# EAGLE schematic CONRAD (EAGLE 9.4.2)

## Sheet 1 of 5
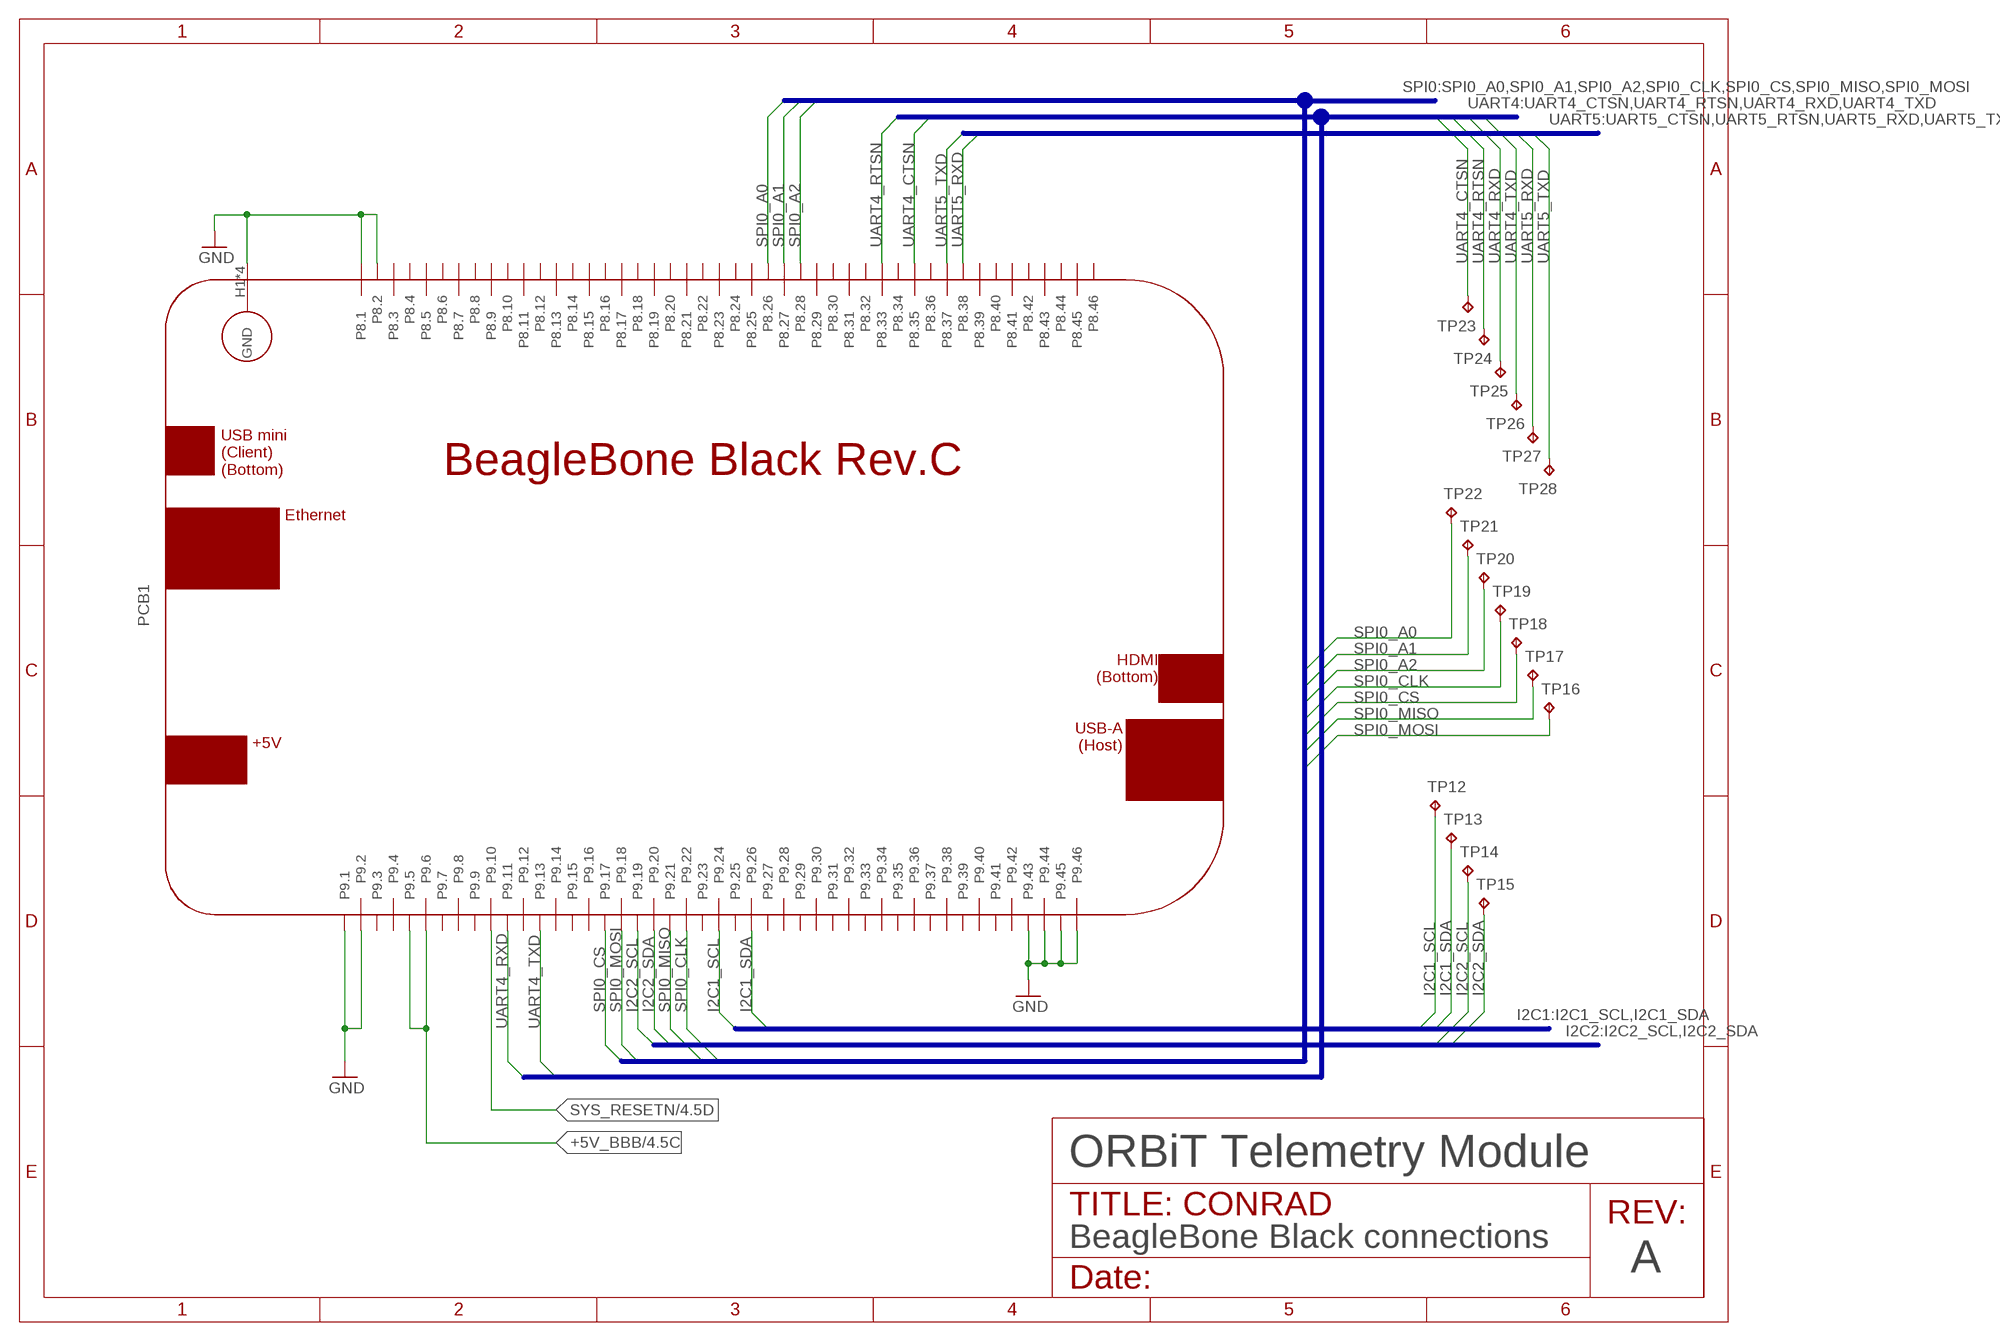
[diagram p0: schematic, sheet 1]

### Parts
PCB1  BBB_CAPE-CUT  [BBB_CAPE_CUT]
TP12  TP063  [TP_063]
TP13  TP063  [TP_063]
TP14  TP063  [TP_063]
TP15  TP063  [TP_063]
TP16  TP063  [TP_063]
TP17  TP063  [TP_063]
TP18  TP063  [TP_063]
TP19  TP063  [TP_063]
TP20  TP063  [TP_063]
TP21  TP063  [TP_063]
TP22  TP063  [TP_063]
TP23  TP063  [TP_063]
TP24  TP063  [TP_063]
TP25  TP063  [TP_063]
TP26  TP063  [TP_063]
TP27  TP063  [TP_063]
TP28  TP063  [TP_063]

### Nets
+5V_BBB: PCB1.P9.5 PCB1.P9.6 ; also sheet 4
GND: PCB1.H1(GND) PCB1.H2(GND) PCB1.H3(GND) PCB1.H4(GND) PCB1.P8.1 PCB1.P8.2 PCB1.P9.1 PCB1.P9.2 PCB1.P9.43 PCB1.P9.44 PCB1.P9.45 PCB1.P9.46 ; also sheet 2,3,4,5
I2C1_SCL: PCB1.P9.24 TP12.TP ; also sheet 2,4
I2C1_SDA: PCB1.P9.26 TP13.TP ; also sheet 2,4
I2C2_SCL: PCB1.P9.19 TP14.TP ; also sheet 4,5
I2C2_SDA: PCB1.P9.20 TP15.TP ; also sheet 4,5
SPI0_A0: PCB1.P8.26 TP22.TP ; also sheet 3
SPI0_A1: PCB1.P8.27 TP21.TP ; also sheet 3
SPI0_A2: PCB1.P8.28 TP20.TP ; also sheet 3
SPI0_CLK: PCB1.P9.22 TP19.TP ; also sheet 3
SPI0_CS: PCB1.P9.17 TP18.TP ; also sheet 3
SPI0_MISO: PCB1.P9.21 TP17.TP ; also sheet 3
SPI0_MOSI: PCB1.P9.18 TP16.TP ; also sheet 3
SYS_RESETN: PCB1.P9.10 ; also sheet 4
UART4_CTSN: PCB1.P8.35 TP23.TP ; also sheet 2
UART4_RTSN: PCB1.P8.33 TP24.TP ; also sheet 2
UART4_RXD: PCB1.P9.11 TP25.TP ; also sheet 2
UART4_TXD: PCB1.P9.13 TP26.TP ; also sheet 2
UART5_RXD: PCB1.P8.38 TP27.TP ; also sheet 2
UART5_TXD: PCB1.P8.37 TP28.TP ; also sheet 2
Unconnected: PCB1.P8.3 PCB1.P8.4 PCB1.P8.5 PCB1.P8.6 PCB1.P8.7 PCB1.P8.8 PCB1.P8.9 PCB1.P8.10 PCB1.P8.11 PCB1.P8.12 PCB1.P8.13 PCB1.P8.14 PCB1.P8.15 PCB1.P8.16 PCB1.P8.17 PCB1.P8.18 PCB1.P8.19 PCB1.P8.20 PCB1.P8.21 PCB1.P8.22 PCB1.P8.23 PCB1.P8.24 PCB1.P8.25 PCB1.P8.29 PCB1.P8.30 PCB1.P8.31 PCB1.P8.32 PCB1.P8.34 PCB1.P8.36 PCB1.P8.39 PCB1.P8.40 PCB1.P8.41 PCB1.P8.42 PCB1.P8.43 PCB1.P8.44 PCB1.P8.45 PCB1.P8.46 PCB1.P9.3 PCB1.P9.4 PCB1.P9.7 PCB1.P9.8 PCB1.P9.9 PCB1.P9.12 PCB1.P9.14 PCB1.P9.15 PCB1.P9.16 PCB1.P9.23 PCB1.P9.25 PCB1.P9.27 PCB1.P9.28 PCB1.P9.29 PCB1.P9.30 PCB1.P9.31 PCB1.P9.32 PCB1.P9.33 PCB1.P9.34 PCB1.P9.35 PCB1.P9.36 PCB1.P9.37 PCB1.P9.38 PCB1.P9.39 PCB1.P9.40 PCB1.P9.41 PCB1.P9.42

### Buses
UART4:UART4_CTSN,UART4_RTSN,UART4_RXD,UART4_TXD
UART5:UART5_CTSN,UART5_RTSN,UART5_RXD,UART5_TXD
SPI0:SPI0_A0,SPI0_A1,SPI0_A2,SPI0_CLK,SPI0_CS,SPI0_MISO,SPI0_MOSI
I2C1:I2C1_SCL,I2C1_SDA
I2C2:I2C2_SCL,I2C2_SDA

### Notes on the sheet
- ORBiT Telemetry Module
- BeagleBone Black connections
- A

## Sheet 2 of 5
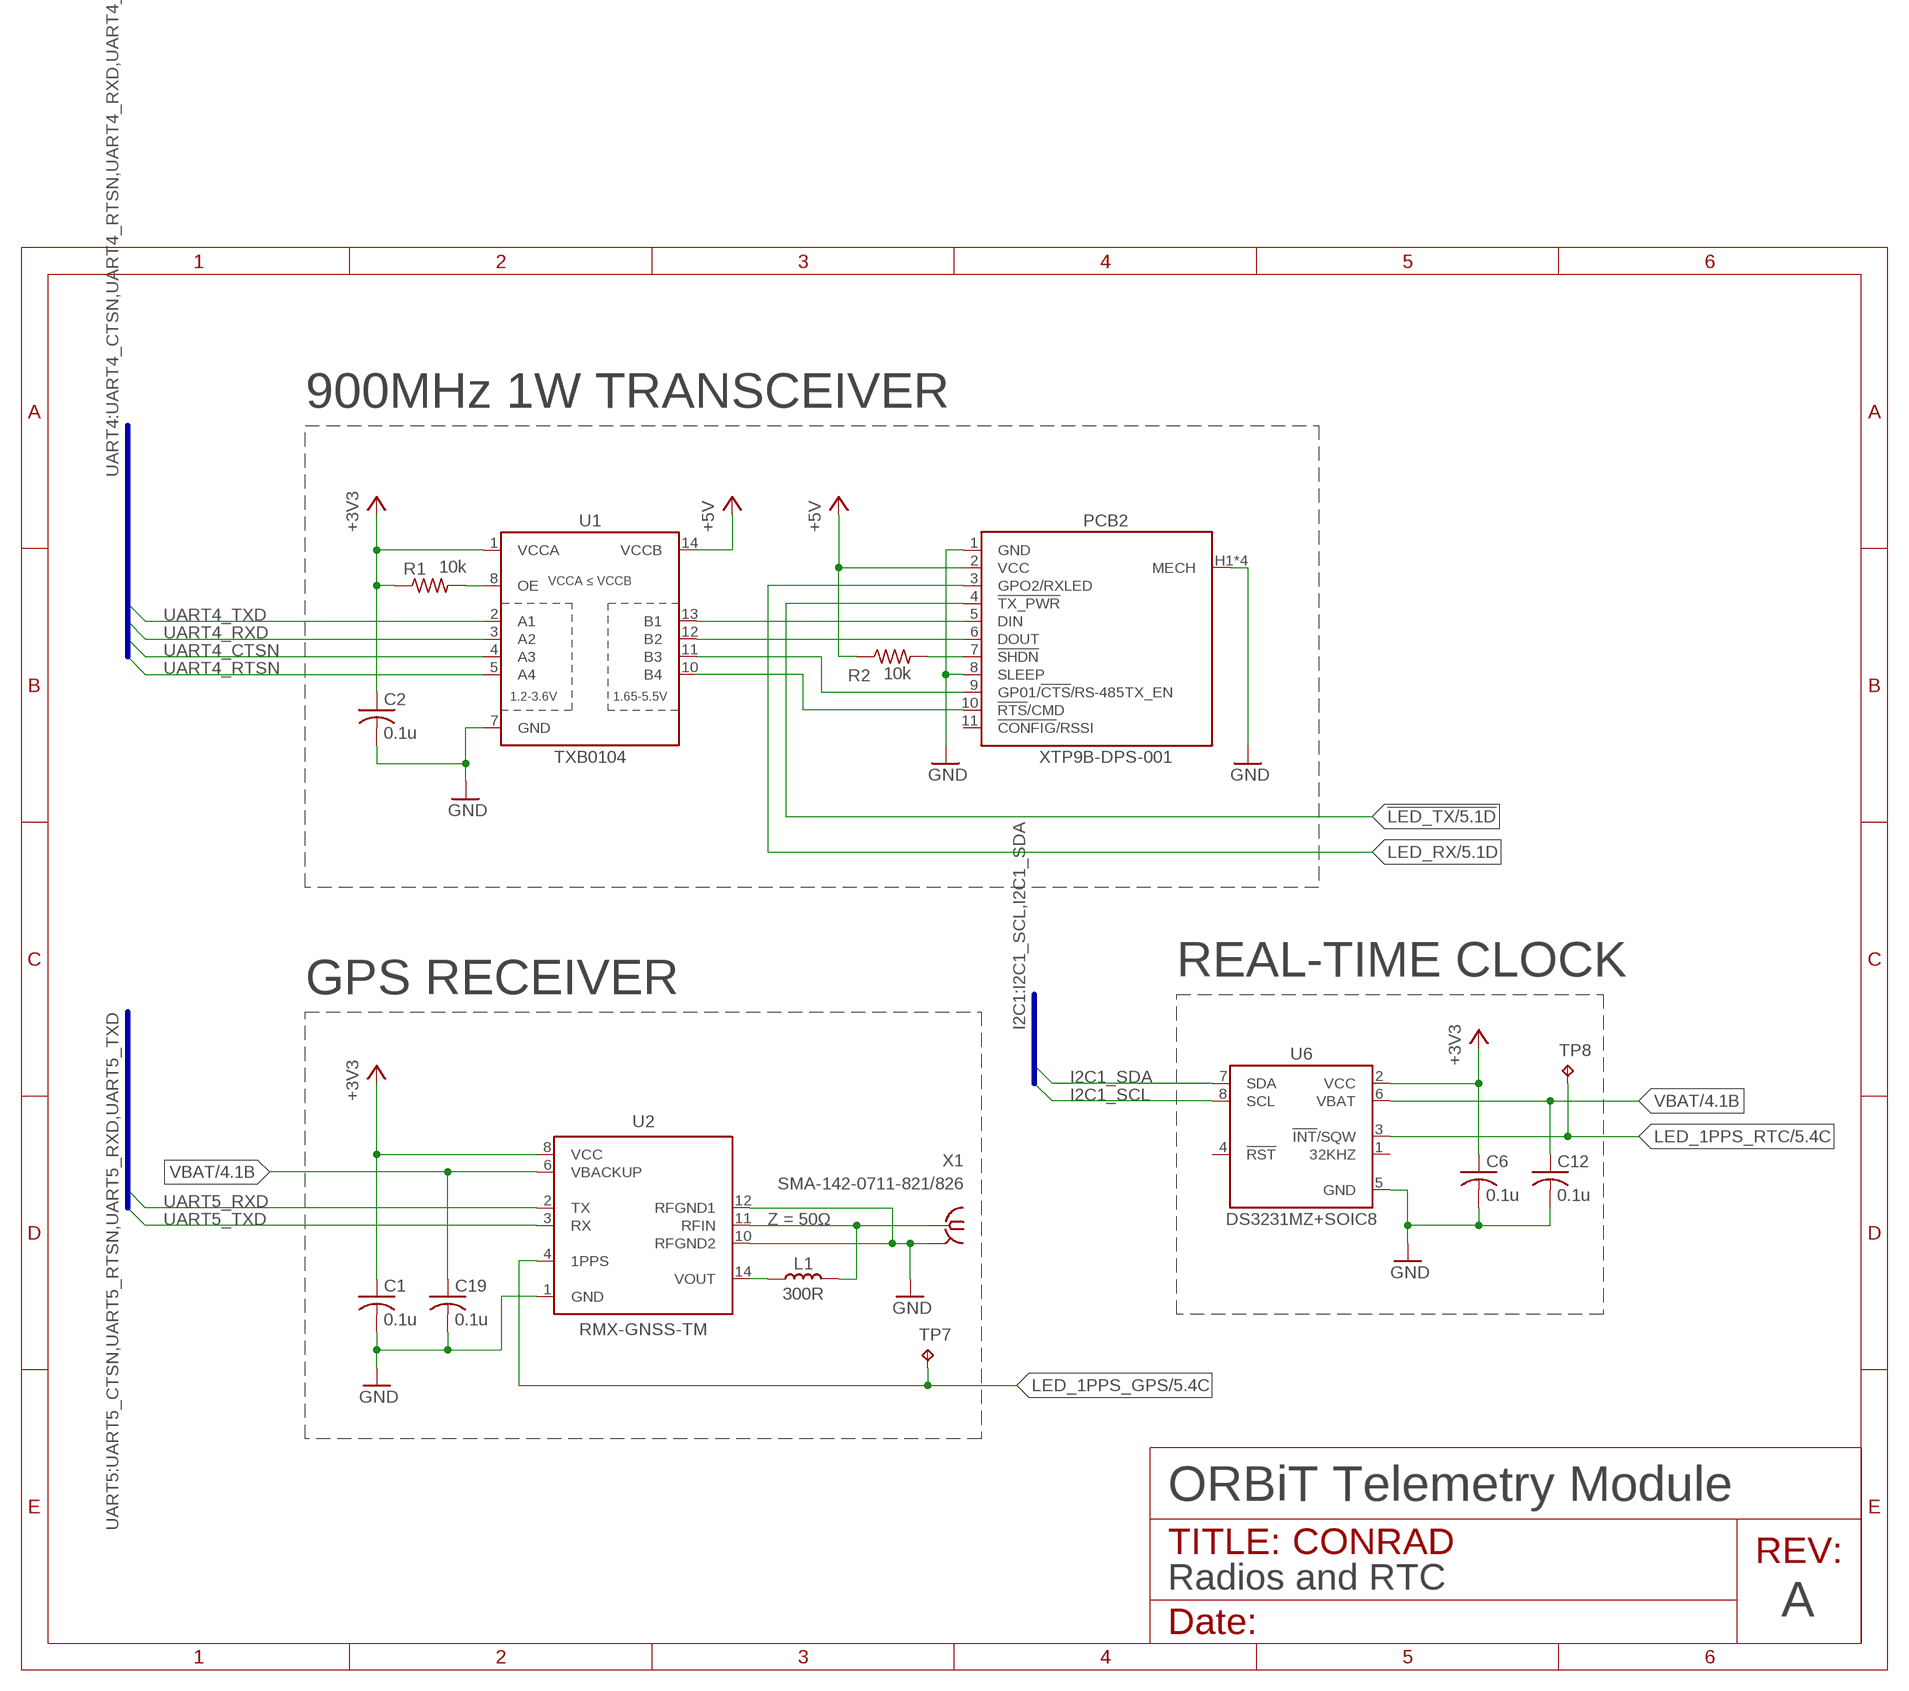
[diagram p1: schematic, sheet 2]

### Parts
C1  0.1u  C-USC0805  [C0805]
C2  0.1u  C-USC0805  [C0805]
C6  0.1u  C-USC0805  [C0805]
C12  0.1u  C-USC0805  [C0805]
C19  0.1u  C-USC0805  [C0805]
L1  300R  L_SMD0402  [0402]
PCB2  DIGI_XTP9B-RPSMA-SMD  [DIGI_XTP9B-SMD]
R1  10k  R-US_R0805  [R0805]
R2  10k  R-US_R0805  [R0805]
TP7  TP063  [TP_063]
TP8  TP063  [TP_063]
U1  TXB0104  TXB0104DR  [SO14]
U2  RMX-GNSS-TM  [RMX-GNSS-TM]
U6  DS3231MZ+SOIC8  [SOIC8-150]
X1  SMA-142-0711-821/826  [J502-ND-142-0711-821/826]

### Nets
!LED_TX: PCB2.4(!TX_PWR!) ; also sheet 5
+3V3: C1.1 C2.1 C6.1 R1.1 U1.1(VCCA) U2.8(VCC) U6.2(VCC) ; also sheet 3,4,5
+5V: U1.14(VCCB) ; also sheet 4,5
GND: C1.2 C2.2 C6.2 C12.2 C19.2 PCB2.1(GND) PCB2.8(SLEEP) PCB2.H1(MECH) PCB2.H2(MECH) PCB2.H3(MECH) PCB2.H4(MECH) U1.7(GND) U2.1(GND) U2.10(RFGND2) U2.12(RFGND1) U6.5(GND) X1.G@1 X1.G@2 X1.G@3 X1.G@4 ; also sheet 1,3,4,5
I2C1_SCL: U6.8(SCL) ; also sheet 1,4
I2C1_SDA: U6.7(SDA) ; also sheet 1,4
LED_1PPS_GPS: TP7.TP U2.4(1PPS) ; also sheet 5
LED_1PPS_RTC: TP8.TP U6.3(!INT!/SQW) ; also sheet 5
LED_RX: PCB2.3(GPO2/RXLED) ; also sheet 5
N$1: PCB2.5(DIN) U1.13(B1)
N$2: PCB2.6(DOUT) U1.12(B2)
N$3: PCB2.9(GP01/!CTS!/RS-485TX_EN) U1.11(B3)
N$4: PCB2.10(!RTS!/CMD) U1.10(B4)
N$5: R1.2 U1.8(OE)
N$6: PCB2.7(!SHDN!) R2.2
N$7: L1.2 U2.11(RFIN) X1.1
N$8: L1.1 U2.14(VOUT)
UART4_CTSN: U1.4(A3) ; also sheet 1
UART4_RTSN: U1.5(A4) ; also sheet 1
UART4_RXD: U1.3(A2) ; also sheet 1
UART4_TXD: U1.2(A1) ; also sheet 1
UART5_RXD: U2.2(TX) ; also sheet 1
UART5_TXD: U2.3(RX) ; also sheet 1
VBAT: C12.1 C19.1 U2.6(VBACKUP) U6.6(VBAT) ; also sheet 4
VCC: PCB2.2(VCC) R2.1 ; supply symbol labelled +5V
Unconnected: PCB2.11(!CONFIG!/RSSI) U6.1(32KHZ) U6.4(!RST)

### Buses
UART4:UART4_CTSN,UART4_RTSN,UART4_RXD,UART4_TXD
UART5:UART5_CTSN,UART5_RTSN,UART5_RXD,UART5_TXD
I2C1:I2C1_SCL,I2C1_SDA

### Notes on the sheet
- 900MHz 1W TRANSCEIVER
- REAL-TIME CLOCK
- GPS RECEIVER
- Z = 50Ω
- ORBiT Telemetry Module
- Radios and RTC
- A

## Sheet 3 of 5
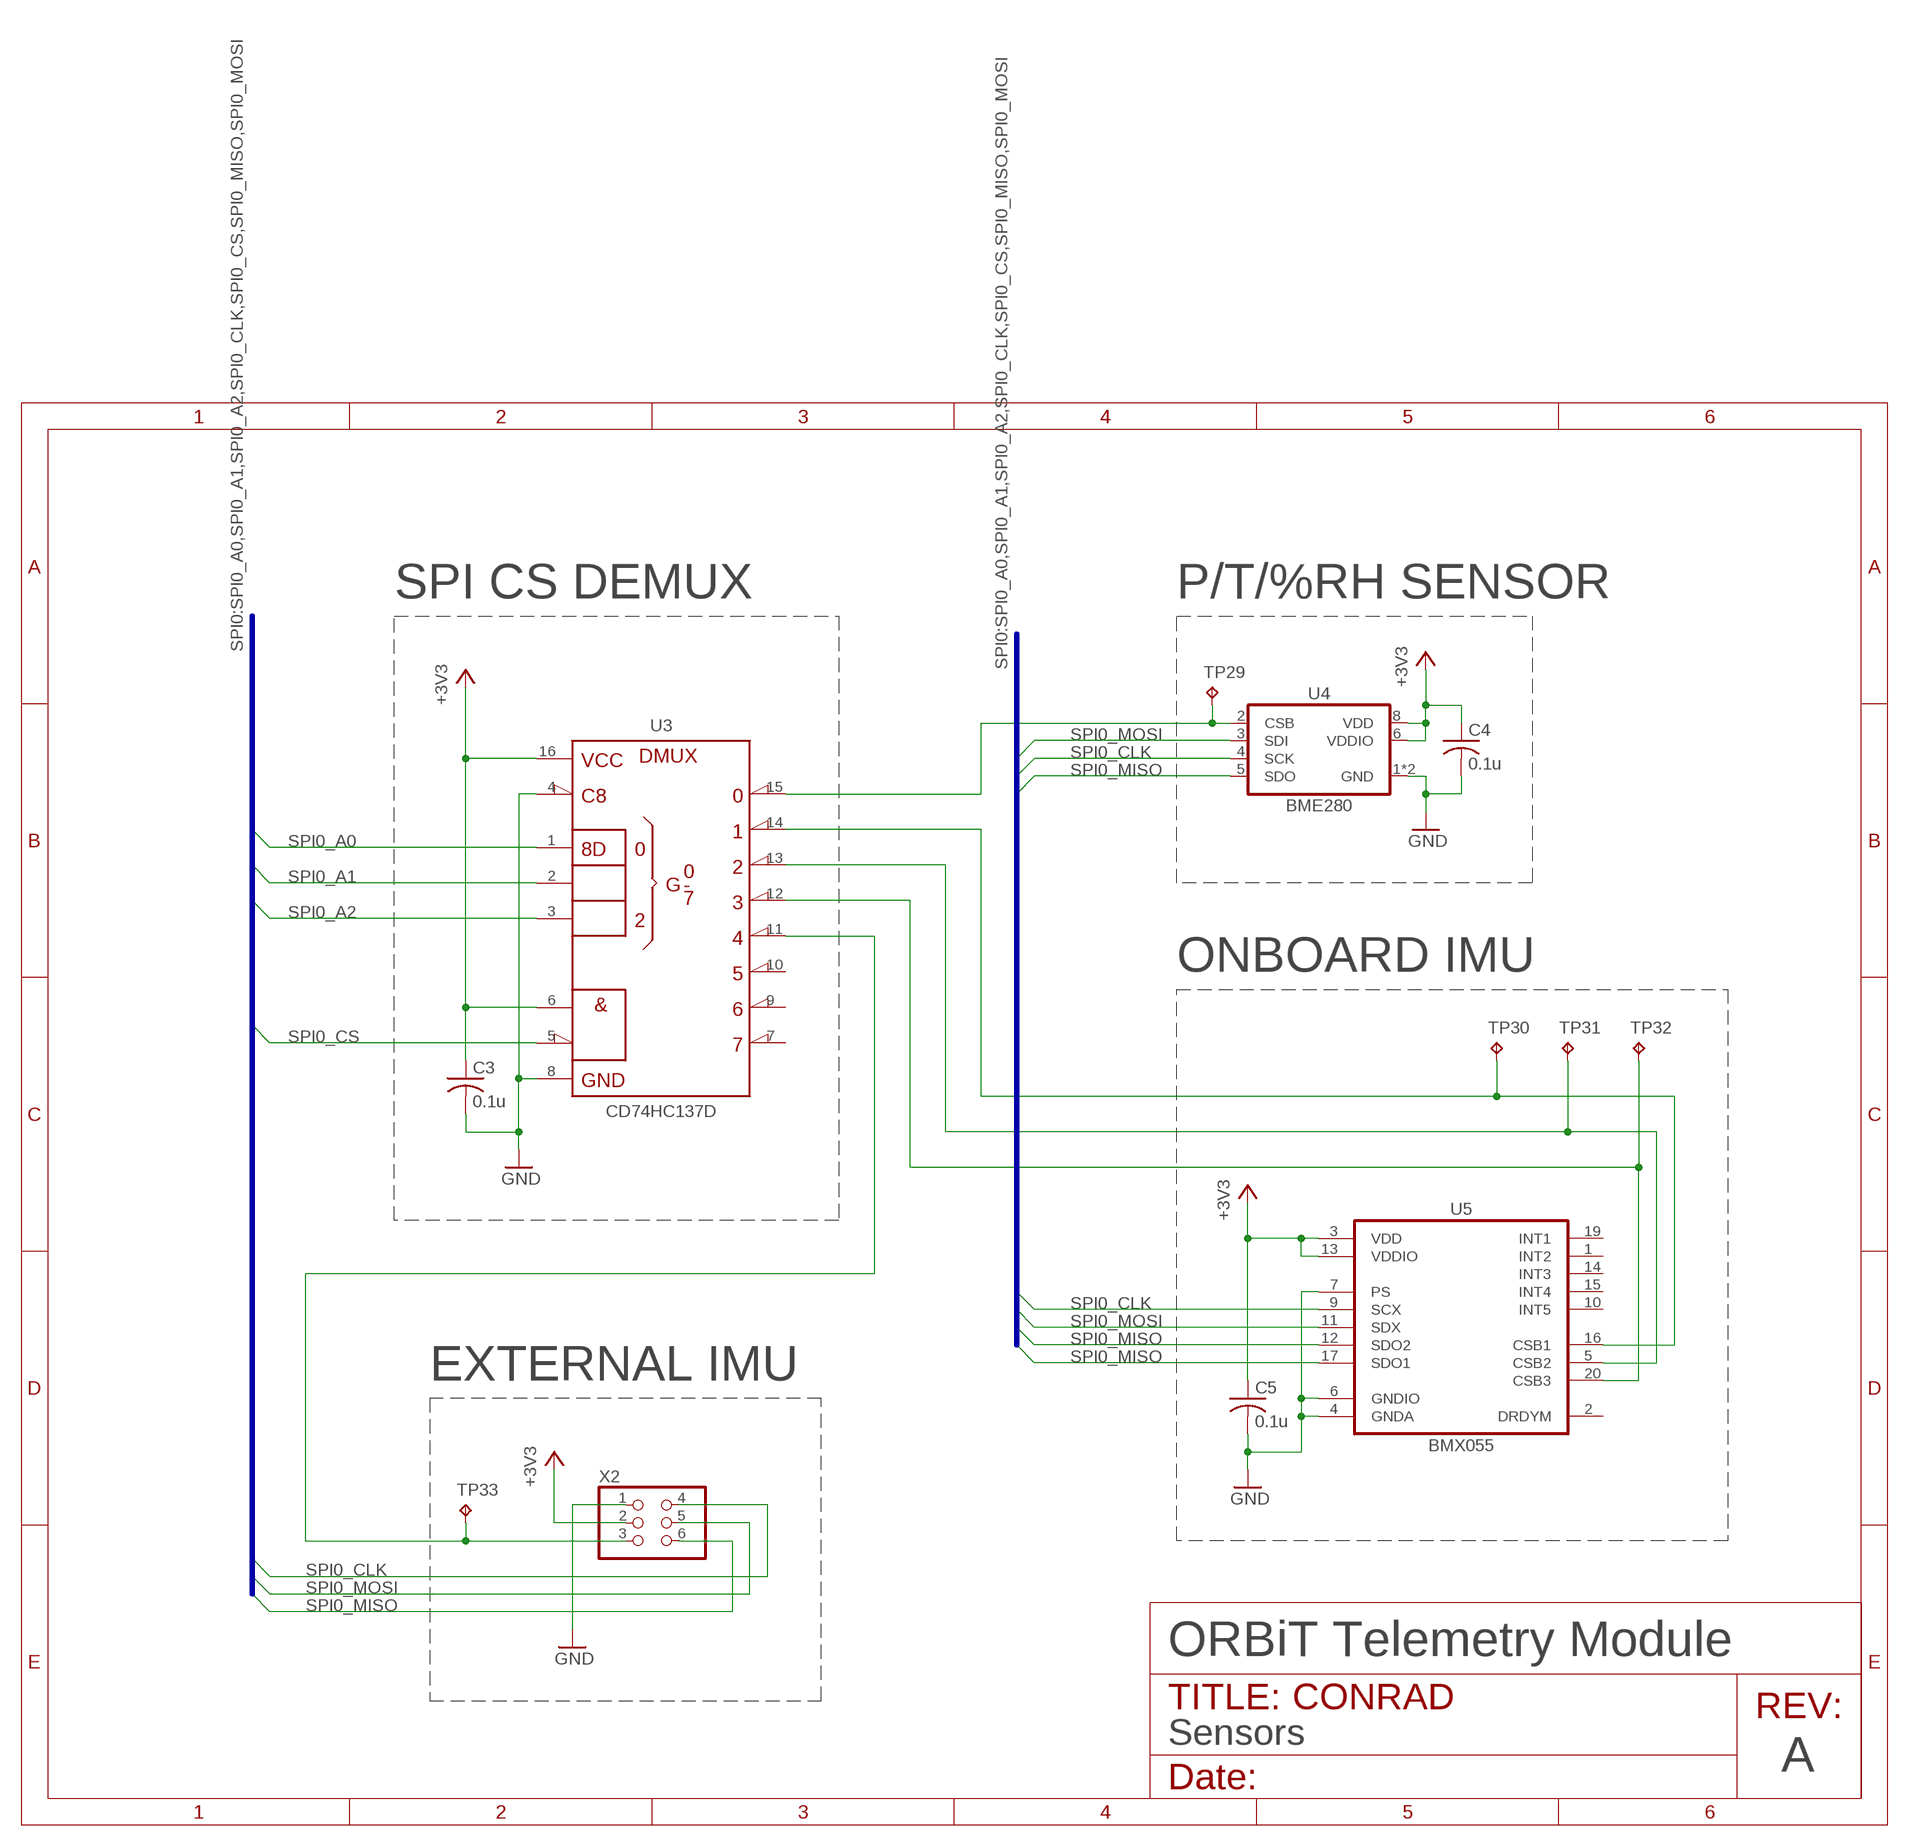
[diagram p2: schematic, sheet 3]

### Parts
C3  0.1u  C-USC0805  [C0805]
C4  0.1u  C-USC0805  [C0805]
C5  0.1u  C-USC0805  [C0805]
TP29  TP063  [TP_063]
TP30  TP063  [TP_063]
TP31  TP063  [TP_063]
TP32  TP063  [TP_063]
TP33  TP063  [TP_063]
U3  CD74HC137D  [SO16]
U4  BME280  [BME280]
U5  BMX055  [BMX055]
X2  105314-06  [105314-**06]

### Nets
+3V3: C3.1 C4.1 C5.1 U3.6(G1) U3.16(VCC) U4.6(VDDIO) U4.8(VDD) U5.3(VDD) U5.13(VDDIO) X2.2 ; also sheet 2,4,5
GND: C3.2 C4.2 C5.2 U3.4(!GL) U3.8(GND) U4.1(GND) U4.7(GND) U5.4(GNDA) U5.6(GNDIO) U5.7(PS) X2.1 ; also sheet 1,2,4,5
N$9: TP33.TP U3.11(Y4) X2.3
N$10: TP29.TP U3.15(Y0) U4.2(CSB)
N$11: TP31.TP U3.13(Y2) U5.5(CSB2)
N$12: TP30.TP U3.14(Y1) U5.16(CSB1)
N$13: TP32.TP U3.12(Y3) U5.20(CSB3)
SPI0_A0: U3.1(A) ; also sheet 1
SPI0_A1: U3.2(B) ; also sheet 1
SPI0_A2: U3.3(C) ; also sheet 1
SPI0_CLK: U4.4(SCK) U5.9(SCX) X2.4 ; also sheet 1
SPI0_CS: U3.5(!G2) ; also sheet 1
SPI0_MISO: U4.5(SDO) U5.12(SDO2) U5.17(SDO1) X2.6 ; also sheet 1
SPI0_MOSI: U4.3(SDI) U5.11(SDX) X2.5 ; also sheet 1
Unconnected: U3.7(Y7) U3.9(Y6) U3.10(Y5) U5.1(INT2) U5.2(DRDYM) U5.10(INT5) U5.14(INT3) U5.15(INT4) U5.19(INT1)

### Buses
SPI0:SPI0_A0,SPI0_A1,SPI0_A2,SPI0_CLK,SPI0_CS,SPI0_MISO,SPI0_MOSI

### Notes on the sheet
- SPI CS DEMUX | P/T/%RH SENSOR
- ONBOARD IMU
- EXTERNAL IMU
- ORBiT Telemetry Module
- Sensors
- A

## Sheet 4 of 5
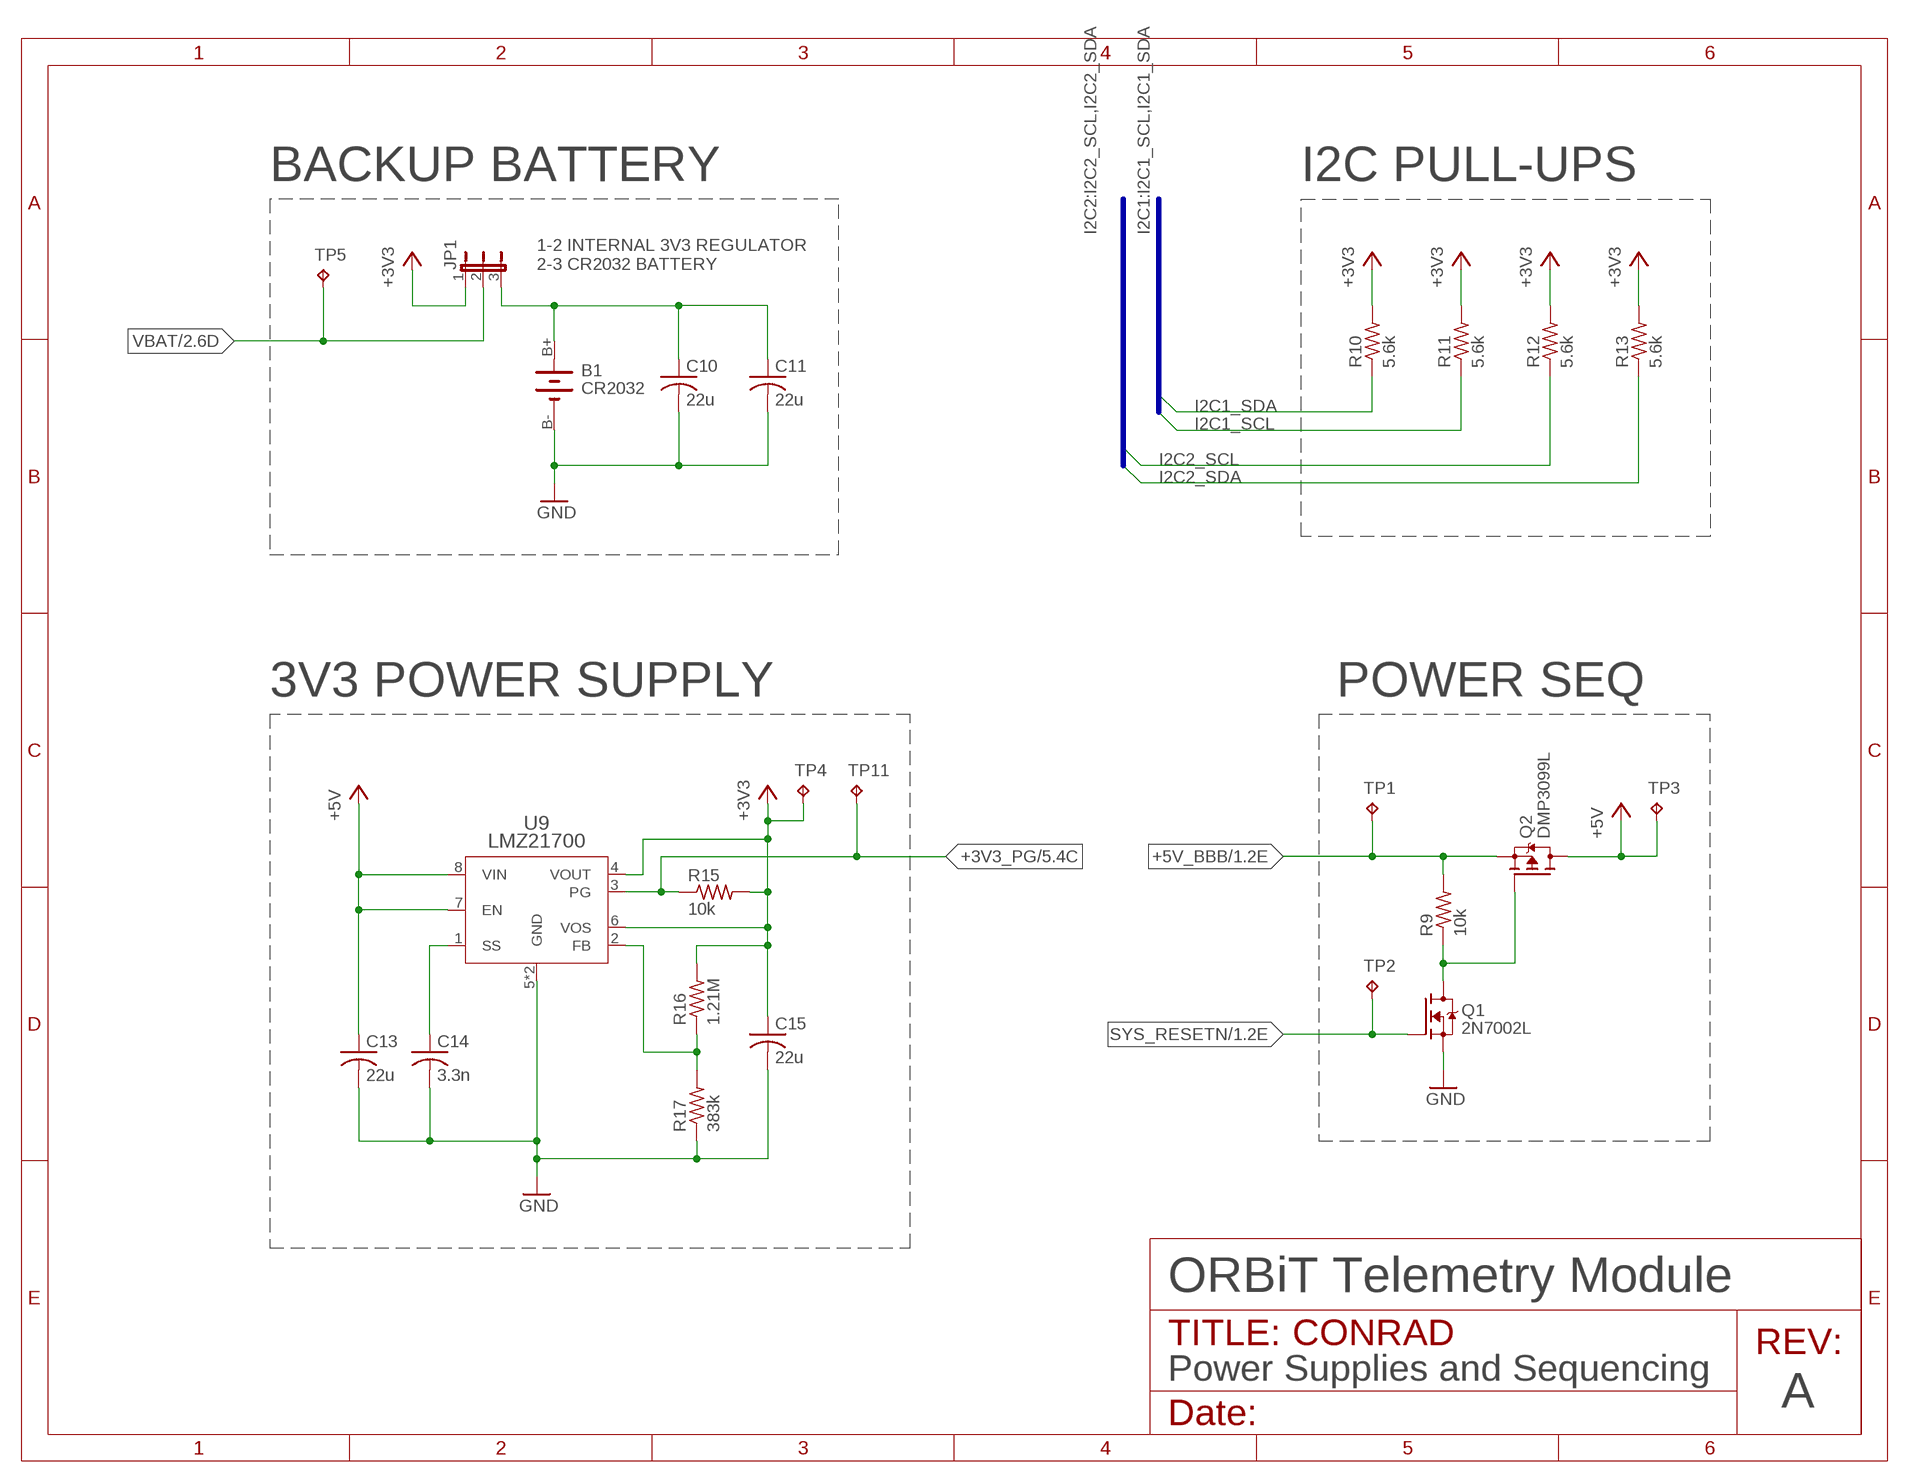
[diagram p3: schematic, sheet 4]

### Parts
B1  CR2032  MPD_BH32T-C-G  [MPD_BH32T-C]
C10  22u  C-USC0805  [C0805]
C11  22u  C-USC0805  [C0805]
C13  22u  C-USC0805  [C0805]
C14  3.3n  C-USC0805  [C0805]
C15  22u  C-USC0805  [C0805]
JP1  JP2E  [JP2]
Q1  2N7002L  NMOSSOT23-3  [SOT23-3]
Q2  DMP3099L  PMOSSOT23-3  [SOT23-3]
R9  10k  R-US_R0805  [R0805]
R10  5.6k  R-US_R0805  [R0805]
R11  5.6k  R-US_R0805  [R0805]
R12  5.6k  R-US_R0805  [R0805]
R13  5.6k  R-US_R0805  [R0805]
R15  10k  R-US_R0805  [R0805]
R16  1.21M  R-US_R0805  [R0805]
R17  383k  R-US_R0805  [R0805]
TP1  TP063  [TP_063]
TP2  TP063  [TP_063]
TP3  TP063  [TP_063]
TP4  TP063  [TP_063]
TP5  TP063  [TP_063]
TP11  TP063  [TP_063]
U9  LMZ21700  [MICROSIP-8]

### Nets
+3V3: C15.1 JP1.1 R10.2 R11.2 R12.2 R13.2 R15.2 R16.2 TP4.TP U9.4(VOUT) U9.6(VOS) ; also sheet 2,3,5
+3V3_PG: R15.1 TP11.TP U9.3(PG) ; also sheet 5
+5V: C13.1 Q2.3(D) TP3.TP U9.7(EN) U9.8(VIN) ; also sheet 2,5
+5V_BBB: Q2.2(S) R9.2 TP1.TP ; also sheet 1
GND: B1.B-(-) C10.2 C11.2 C13.2 C14.2 C15.2 Q1.2(S) R17.1 U9.5(GND) U9.PAD(GND) ; also sheet 1,2,3,5
I2C1_SCL: R11.1 ; also sheet 1,2
I2C1_SDA: R10.1 ; also sheet 1,2
I2C2_SCL: R12.1 ; also sheet 1,5
I2C2_SDA: R13.1 ; also sheet 1,5
N$24: Q1.3(D) Q2.1(G) R9.1
N$26: C14.1 U9.1(SS)
N$28: R16.1 R17.2 U9.2(FB)
N$34: B1.B+(+) C10.1 C11.1 JP1.3
SYS_RESETN: Q1.1(G) TP2.TP ; also sheet 1
VBAT: JP1.2 TP5.TP ; also sheet 2

### Buses
I2C1:I2C1_SCL,I2C1_SDA
I2C2:I2C2_SCL,I2C2_SDA

### Notes on the sheet
- BACKUP BATTERY | I2C PULL-UPS
- 1-2 INTERNAL 3V3 REGULATOR
  2-3 CR2032 BATTERY
- 3V3 POWER SUPPLY | POWER SEQ
- ORBiT Telemetry Module
- Power Supplies and Sequencing
- A

## Sheet 5 of 5
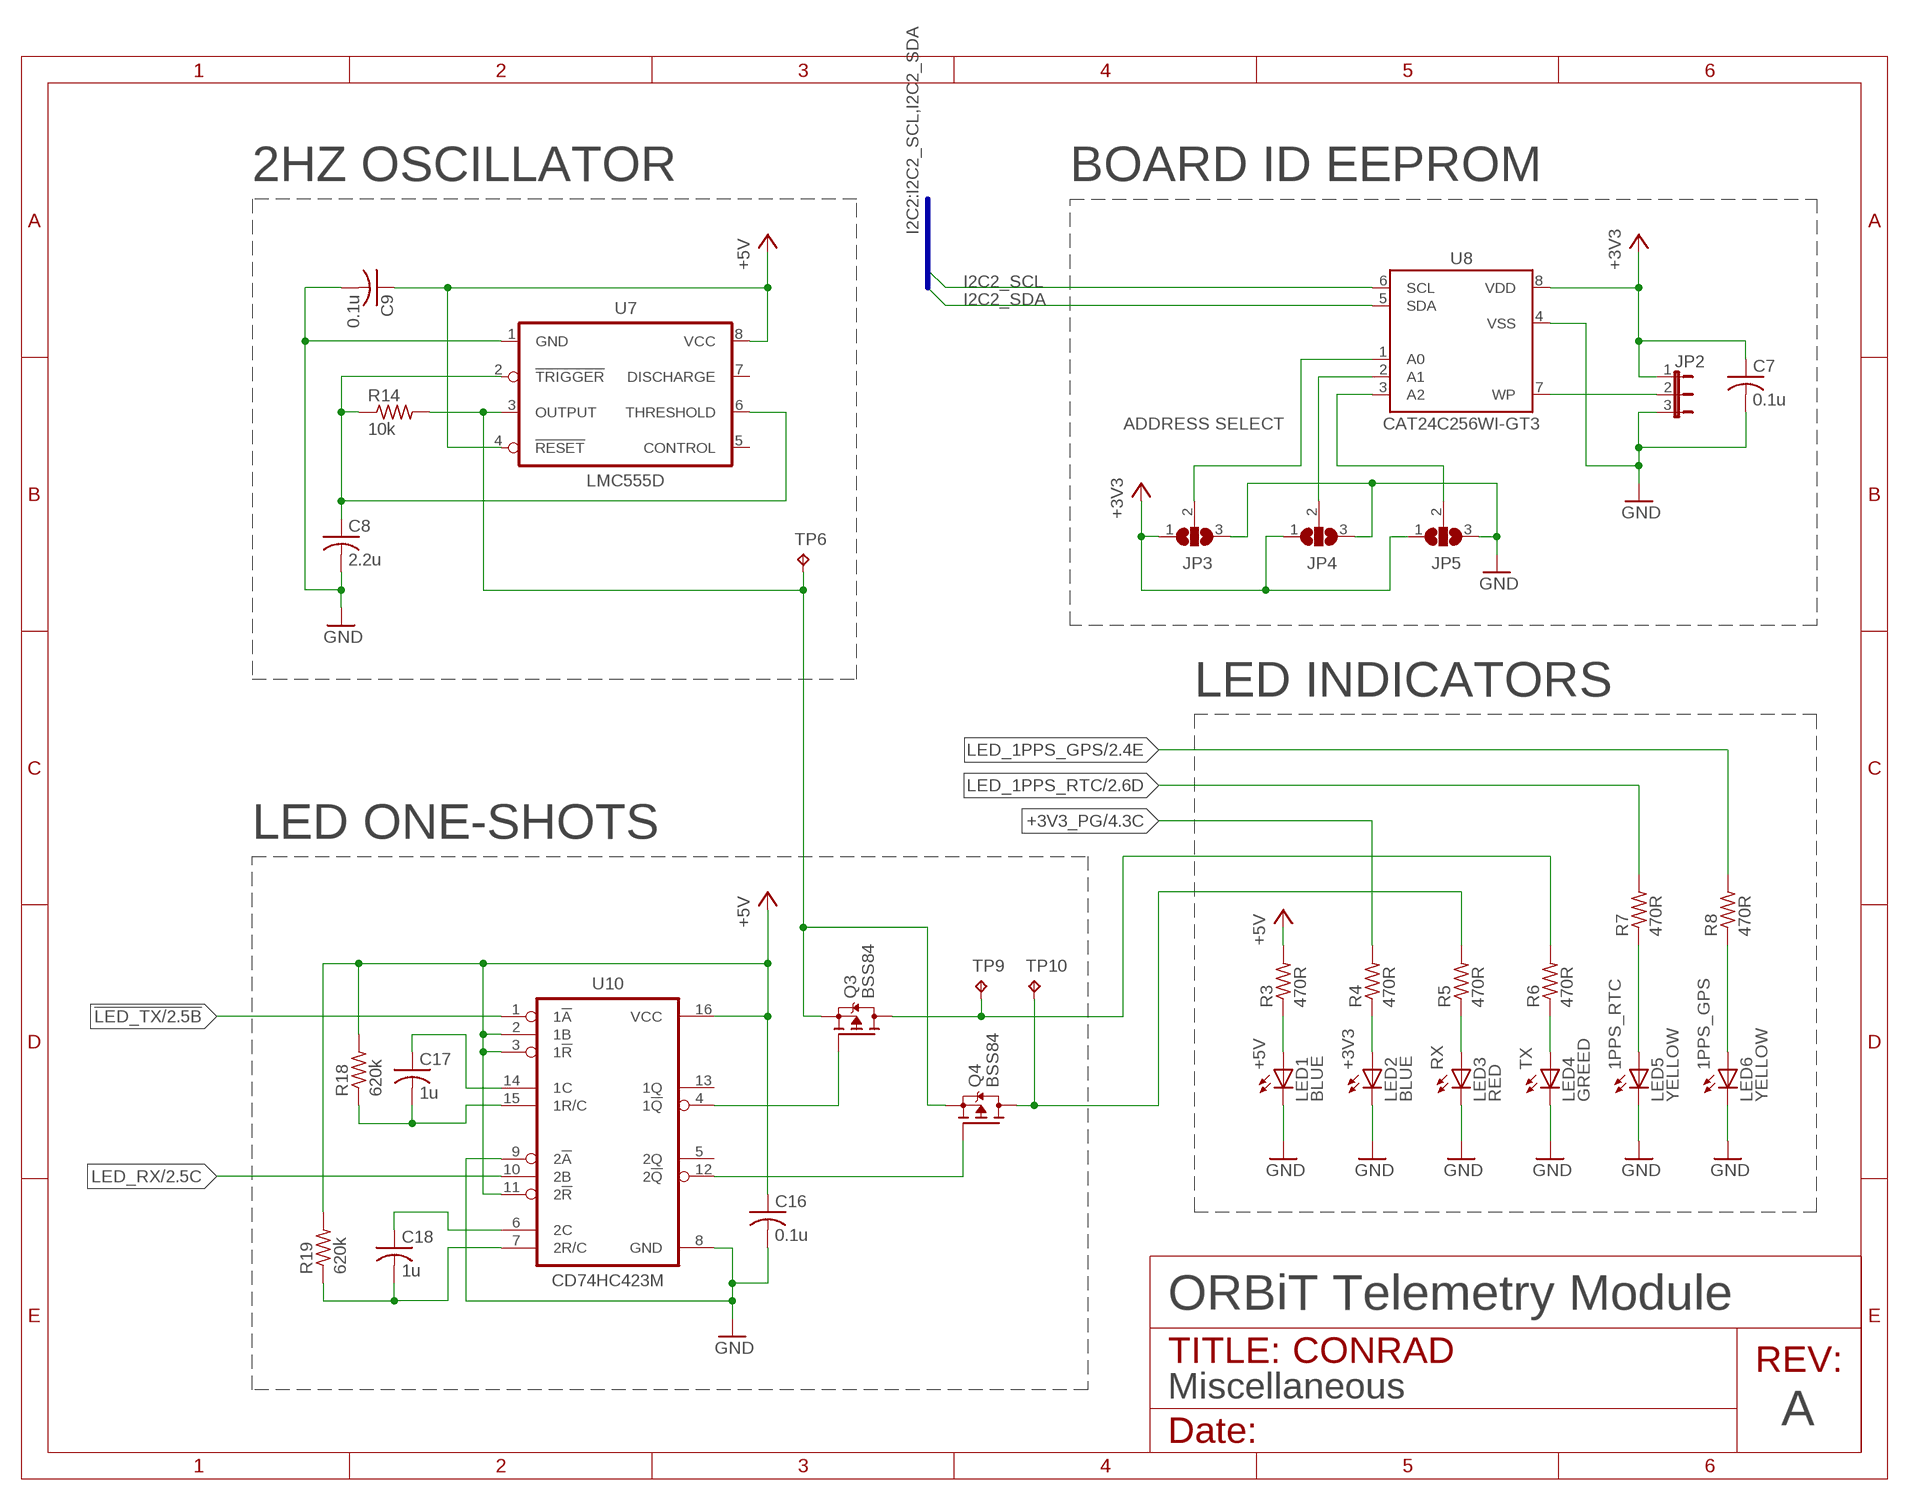
[diagram p4: schematic, sheet 5]

### Parts
C7  0.1u  C-USC0805  [C0805]
C8  2.2u  C-USC0805  [C0805]
C9  0.1u  C-USC0805  [C0805]
C16  0.1u  C-USC0805  [C0805]
C17  1u  C-USC0805  [C0805]
C18  1u  C-USC0805  [C0805]
JP2  JP2E  [JP2]
JP3  SJ2W  [SJ_2]
JP4  SJ2W  [SJ_2]
JP5  SJ2W  [SJ_2]
LED1  BLUE  LEDSML0805  [SML0805]
LED2  BLUE  LEDSML0805  [SML0805]
LED3  RED  LEDSML0805  [SML0805]
LED4  GREED  LEDSML0805  [SML0805]
LED5  YELLOW  LEDSML0805  [SML0805]
LED6  YELLOW  LEDSML0805  [SML0805]
Q3  BSS84  PMOSSOT23-3  [SOT23-3]
Q4  BSS84  PMOSSOT23-3  [SOT23-3]
R3  470R  R-US_R0805  [R0805]
R4  470R  R-US_R0805  [R0805]
R5  470R  R-US_R0805  [R0805]
R6  470R  R-US_R0805  [R0805]
R7  470R  R-US_R0805  [R0805]
R8  470R  R-US_R0805  [R0805]
R14  10k  R-US_R0805  [R0805]
R18  620k  R-US_R0805  [R0805]
R19  620k  R-US_R0805  [R0805]
TP6  TP063  [TP_063]
TP9  TP063  [TP_063]
TP10  TP063  [TP_063]
U7  LMC555D  [SOIC8-150]
U8  CAT24C256WI-GT3  [SOIC8-150]
U10  CD74HC423M  [SO16]

### Nets
!LED_TX: U10.1(1!A) ; also sheet 2
+3V3: C7.1 JP2.1 JP3.1 JP4.1 JP5.1 U8.8(VDD) ; also sheet 2,3,4
+3V3_PG: R4.2 ; also sheet 4
+5V: C9.1 C16.1 R3.2 R18.2 R19.2 U7.4(!RESET) U7.8(VCC) U10.2(1B) U10.3(1!R) U10.11(2!R) U10.16(VCC) ; also sheet 2,4
GND: C7.2 C8.2 C9.2 C16.2 JP2.3 JP3.3 JP4.3 JP5.3 LED1.C LED2.C LED3.C LED4.C LED5.C LED6.C U7.1(GND) U8.4(VSS) U10.8(GND) U10.9(2!A) ; also sheet 1,2,3,4
I2C2_SCL: U8.6(SCL) ; also sheet 1,4
I2C2_SDA: U8.5(SDA) ; also sheet 1,4
LED_1PPS_GPS: R8.2 ; also sheet 2
LED_1PPS_RTC: R7.2 ; also sheet 2
LED_RX: U10.10(2B) ; also sheet 2
LED_RX_MV: Q3.3(D) R6.2 TP9.TP
LED_TX_MV: Q4.3(D) R5.2 TP10.TP
N$14: LED4.A R6.1
N$15: LED3.A R5.1
N$16: LED2.A R4.1
N$17: LED1.A R3.1
N$18: LED6.A R8.1
N$19: LED5.A R7.1
N$20: JP3.2 U8.1(A0)
N$21: JP4.2 U8.2(A1)
N$22: JP5.2 U8.3(A2)
N$23: JP2.2 U8.7(WP)
N$25: C8.1 R14.1 U7.2(!TRIGGER) U7.6(THRESHOLD)
N$27: C17.2 R18.1 U10.15(1R/C)
N$29: C17.1 U10.14(1C)
N$30: C18.2 R19.1 U10.7(2R/C)
N$31: C18.1 U10.6(2C)
N$32: Q4.1(G) U10.12(2!Q)
N$33: Q3.1(G) U10.4(1!Q)
OSC_2HZ: Q3.2(S) Q4.2(S) R14.2 TP6.TP U7.3(OUTPUT)
Unconnected: U7.5(CONTROL) U7.7(DISCHARGE) U10.5(2Q) U10.13(1Q)

### Buses
I2C2:I2C2_SCL,I2C2_SDA

### Notes on the sheet
- 2HZ OSCILLATOR | BOARD ID EEPROM
- ADDRESS SELECT
- LED INDICATORS
- LED ONE-SHOTS
- +5V | +3V3 | RX | TX | 1PPS_RTC | 1PPS_GPS
- ORBiT Telemetry Module
- Miscellaneous
- A

## Library data of the parts
B1 = ORBiT-batteries:MPD_BH32T-C: MPD BH32T-C CR2032 Battery Holder CR2032 Holder. Also accepts CR2025, BR2025, BR2032, and other smaller cells.; MF: Memory Protection Devices; MPN: BH32T-C-G; PN_DIGIKEY: BH32T-C-G-ND
C1-C19 = rcl:C-US: CAPACITOR, American symbol; SPICEPREFIX: C
JP1 JP2 = jumper:JP2E: JUMPER
JP3-JP5 = jumper:SJ2W: SMD solder JUMPER
L1 = ORBiT-inductors:L_SMD: Surface-Mount Inductor
LED1-LED6 = led:LED: LED OSRAM: - CHIPLED LG R971, LG N971, LY N971, LG Q971, LY Q971, LO R971, LY R971 LH N974, LH R974 LS Q976, LO Q976, LY Q976 LO Q996 - Hyper CHIPLED LW Q18S LB Q993, LB Q99A, LB R99A - SideLED LS A670, LO A670, LY A670, LG A670, LP A670 LB A673, LV A673, LT A673, LW A673 LH A674 LY A675 LS A676, LA A676, LO A676, LY A676, LW A676 LS A679, LY A679, LG A679 - Hyper Micro SIDELED® LS Y876, LA Y876, LO Y876, LY Y876 LT Y87S - SmartLED LW L88C, LW L88S LB L89C, LB L89S, LG L890 LS L89K, LO L89K, LY L89K LS L896, LA L896, LO L896, LY L896 - TOPLED LS T670, LO T670, LY T670, LG T670, LP T670 LSG T670, LSP T670, LSY T670, LOP T670, LYG T670 LG T671, LOG T671, LSG T671 LB T673, LV T673, LT T673, LW T673 LH T674 LS T676, LA T676, LO T676, LY T676, LB T676, LH T676, LSB T676, LW T676 LB T67C, LV T67C, LT T67C, LS T67K, LO T67K, LY T67K, LW E67C LS E67B, LA E67B, LO E67B, LY E67B, LB E67C, LV E67C, LT E67C LW T67C LS T679, LY T679, LG T679 LS T770, LO T770, LY T770, LG T770, LP T770 LB T773, LV T773, LT T773, LW T773 LH T774 LS E675, LA E675, LY E675, LS T675 LS T776, LA T776, LO T776, LY T776, LB T776 LHGB T686 LT T68C, LB T68C - Hyper Mini TOPLED® LB M676 - Mini TOPLED Santana® LG M470 LS M47K, LO M47K, LY M47K Source: http://www.osram.convergy.de LUXEON: - LUMILED® LXK2-PW12-R00, LXK2-PW12-S00, LXK2-PW14-U00, LXK2-PW14-V00 LXK2-PM12-R00, LXK2-PM12-S00, LXK2-PM14-U00 LXK2-PE12-Q00, LXK2-PE12-R00, LXK2-PE12-S00, LXK2-PE14-T00, LXK2-PE14-U00 LXK2-PB12-K00, LXK2-PB12-L00, LXK2-PB12-M00, LXK2-PB14-N00, LXK2-PB14-P00, LXK2-PB14-Q00 LXK2-PR12-L00, LXK2-PR12-M00, LXK2-PR14-Q00, LXK2-PR14-R00 LXK2-PD12-Q00, LXK2-PD12-R00, LXK2-PD12-S00 LXK2-PH12-R00, LXK2-PH12-S00 LXK2-PL12-P00, LXK2-PL12-Q00, LXK2-PL12-R00 Source: www.luxeon.com KINGBRIGHT: KA-3528ASYC Source: www.kingbright.com
PCB1 = ORBiT-modules:BBB_CAPE: BeagleBone Black Rev. C The BeagleBone Black (BBONE-BLACK-4G) is a low cost, high-expansion focused BeagleBoard using a low cost Sitara™ AM3358 ARM® Cortex™-A8 processor from Texas Instruments. BBONE-BLACK-4G ships with the Ångström Linux distribution preinstalled on the onboard FLASH, ready to start evaluation and development. Many other Linux distributions and operating systems are also supported by BeagleBone Black including Ubuntu, Android, and Fedora. Like its predecessors, the BeagleBone Black is designed to address the Open Source Community, early adopters, and anyone interested in a low cost ARM® Cortex™-A8 based processor. It has been equipped with a minimum set of features to allow the user to experience the power of the processor and also offers access to many of the interfaces and allows for the use of add-on boards called capes, to add many different combinations of features. A user may also develop their own board or add their own circuitry. The BBONE-BLACK-4G features TI's Sitara™ AM3358AZCZ100 microprocessor, which is based on ARM®Cortex™-A8 core with enhanced image, graphics processing, peripherals and industrial interface options such as EtherCAT and PROFIBUS. The board is equipped with 256Mb x16 DDR3L 4Gb (512MB) SDRAM, 32KB EEPROM, and 4GB embedded MMC (eMMC) Flash as the default boot source. The board is also populated with a single microSD connector to act as a secondary boot source for the board and, if selected as such, can be the primary boot source. The BeagleBone Black supports four boot modes, including eMMC boot, microSD boot, serial boot, and USB boot. A switch is provided to allow switching between the modes. In contrast to the original BeagleBone, the BBONE-BLACK-4G has an onboard HDMI interface to connect directly to TVs and monitors. Other features include a 10/100 Ethernet interface, a serial debug port, a PC USB interface, an USB 2.0 host port, a reset button, a power button, and five indicating blue LEDs. The BeagleBone Black has the ability to accept up to four expansion boards or capes that can be stacked onto the expansion headers. The majority of capes designed for the original BeagleBone will work on the BeagleBone Black. Technical Data: beagleboard.org <https://beagleboard.org/black>; MF: BeagleBoard; MPN: BBONE-BLACK-4G; PN_DIGIKEY: BBB01-SC-505-ND; PN_MOUSER: 958-BBB01-SC-505
PCB2 = ORBiT-modules:DIGI_XTP9B: Digi XTend® OEM RF Modules The XTend OEM RF module provides unprecedented range in a low-cost wireless data solution. The module is easy to use, requires minimal power, provides reliable delivery of critical data between devices and is now available in the even smaller Digi XBee® Surface Mount form factor to save valuable PCB space. The XTend module utilizes FHSS (Frequency Hopping Spread Spectrum) agility to avoid interference by hopping to a new frequency on every packet transmission or re-transmission. Its transmit power is software adjustable from 100 mW to 1 W—the maximum output power allowable by governments that use 900 MHz as a license-free band. The XTend module is approved for use in the United States, Canada, Australia and other countries (contact Digi for a complete listing). Innovations stamped in its design enable the XTend module to supply two- to eight-times the range of other modules operating within the unlicensed 900 MHz frequency band. The range gained by OEMs and integrators is due to proprietary technologies embedded into each module, including superior RX (receiver) sensitivity, interference immunity, modulation/demodulation techniques and others. Technical data: Digi XTend® 900MHz <https://www.digi.com/products/xbee-rf-solutions/sub-1-ghz-modules/xtend-module>; MF: Digi Internation; MPN: XTP9B-DPS-001; PN_DIGIKEY: 602-1871-ND; PN_MOUSER: 888-XTP9B-DPS-001
Q1 = ORBiT-transistors:NMOS: Generic N-channel MOSFET
Q2-Q4 = ORBiT-transistors:PMOS: Generic P-channel MOSFET
R1-R19 = rcl:R-US_: RESISTOR, American symbol; SPICEPREFIX: R
TP1-TP33 = ORBiT-special:TP: Test Point, 0.063" Through-Hole
U1 = ORBiT-IC-TI:TXB0104: TXB0104 4-Bit Bidirectional Voltage-level Translator With Automatic Direction Sensing and ±15-kV ESD Protection This TXB0104 4-bit noninverting translator uses two separate configurable power-supply rails. The A port is designed to track VCCA. VCCA accepts any supply voltage from 1.2 V to 3.6 V. The B port is designed to track VCCB. VCCB accepts any supply voltage from 1.65 V to 5.5 V. This allows for universal low-voltage bidirectional translation between any of the 1.2-V, 1.5-V, 1.8-V, 2.5-V, 3.3-V, and 5-V voltage nodes. VCCA must not exceed VCCB. When the OE input is low, all outputs are placed in the high-impedance state. To ensure the high-impedance state during power up or power down, OE must be tied to GND through a pulldown resistor The current sourcing capability of the driver determines the minimum value of the resistor. The TXB0104 device is designed so the OE input circuit is supplied by VCCA. This device is fully specified for partial power-down applications using IOFF. The I OFF circuitry disables the outputs, which prevents damaging current backflow through the device when the device is powered down. Features: 1.2-V to 3.6-V on A Port and 1.65-V to 5.5-V on B Port (VCCA ≤ VCCB) VCC Isolation Feature: If Either VCC Input Is at GND, All Outputs Are in the High-Impedance State Output Enable (OE) Input Circuit Referenced to VCCA Low Power Consumption, 5-µA Maximum ICC I OFF Supports Partial Power-Down Mode Operation Latch-Up Performance Exceeds 100 mA Per JESD 78, Class II ESD Protection Exceeds JESD 22 A Port: 2500-V Human-Body Model (A114-B) 1500-V Charged-Device Model (C101) B Port: ±15-kV Human-Body Model (A114-B) 1500-V Charged-Device Model (C101) Technical data: TXB0104 4-Bit Bidirectional Voltage-Level Shifter with Auto Direction Sensing and +/-15 kV ESD Protect <http://www.ti.com/product/txb0104>; MF: Texas Instruments; MPN: TXB0104DR; PN_DIGIKEY: 296-21928-1-ND; PN_MOUSER: 595-TXB0104DR
U2 = ORBiT-IC-Linx:RMX-GNSS-TM: Linx TM Series GNSS Receiver Module The TM Series GNSS receiver module is a self-contained high-performance Global Satellite Navigation System receiver. Based on the MediaTek chipset, it can simultaneously acquire and track multiple satellite constellations. These include the United States GPS system, Europe’s GALILEO, Russia’s GLONASS and Japan’s QZSS. The module has an internal Low Noise Amplifier (LNA) that provides exceptional sensitivity, even in dense foliage and urban canyons. It’s very low power consumption helps maximize runtimes in battery powered applications. Hybrid ephemeris prediction can be used to achieve cold start times of less than 15 seconds. The module outputs standard NMEA data through a UART interface. Housed in a tiny reflow-compatible SMD package, the receiver requires no programming or additional RF components (except an antenna) to form a complete GNSS solution. This makes the TM Series easy to integrate, even by engineers without previous RF or GNSS experience. Technical data: TM Series GNSS Receiver Module <https://linxtechnologies.com/wp/product/tm-series-gnss-receiver-module/>; MF: Linx Technologies; MPN: RXM-GNSS-TM; PN_DIGIKEY: RXM-GNSS-TM-TCT-ND; PN_MOUSER: 712-RXM-GNSS-TM-B
U3 = ORBiT-IC-Nexperia:CD74HC137: 74HC137 3-to-8 line decoder, demultiplexer with address latches; inverting The 74HC137 is a high-speed Si-gate CMOS device and is pin compatible with low power Schottky TTL (LSTTL). The 74HC137 is specified in compliance with JEDEC standard no. 7A. The 74HC137 is a 3-to-8 line decoder, demultiplexer with latches at the three address inputs (An). The 74HC137 essentially combines the 3-to-8 decoder function with a 3-bit storage latch. When the latch is enabled (LE = LOW), the 74HC137 acts as a 3-to-8 active LOW decoder. When the latch enable (LE) goes from LOW-to-HIGH, the last data present at the inputs before this transition, is stored in the latches. Further address changes are ignored as long as LE remains HIGH. The output enable input (E1 and E2) controls the state of the outputs independent of the address inputs or latch operation. All outputs are HIGH unless E1 is LOW and E2 is HIGH. The 74HC137 is ideally suited for implementing non-overlapping decoders in 3-state systems and strobed (stored address) applications in bus oriented systems. Features: Combines 3-to-8 decoder with 3-bit latch Multiple input enable for easy expansion or independent controls Active LOW mutually exclusive outputs Low-power dissipation Complies with JEDEC standard no. 7A ESD protection: HBM EIA/JESD22-A114-B exceeds 2000 V MM EIA/JESD22-A115-A exceeds 200 V Specified from -40 °C to +80 °C and from -40 °C to +125 °C Technical data: 74HC137 3-to-8 line decoder, demultiplexer with address latches; inverting | Nexperia <https://www.nexperia.com/products/logic/i-o-expansion-logic/decoders-demultiplexers/series/74HC137.html>; MF: Nexperia; MPN: 74HC137D; PN_DIGIKEY: 1727-6312-1-ND; PN_MOUSER: 771-74HC137D-T
U4 = ORBiT-IC-Bosch:BME280: Bosch BME280 Integrated Environmental Units The BME280 is an integrated environmental sensor developed specifically for mobile applications where size and low power consumption are key design constraints. The unit combines individual high linearity, and high accuracy sensors for pressure, humidity and temperature in an 8-pin metal-lid 2.5 x 2.5 x 0.93 mm3 LGA package. The BME280 designed for low current consumption (3.6 μA @ 1Hz), long term stability, and high EMC robustness. The humidity sensor features an extremely fast response time which supports performance requirements for emerging applications such as: context awareness, and high accuracy over a wide temperature range. The pressure sensor is an absolute barometric pressure sensor which features exceptionally high accuracy and resolution at very low noise. The integrated temperature sensor has been optimized for very low noise and high resolution. It is primarily used for temperature compensation of the pressure and humidity sensors, and can also be used for estimating ambient temperature. The BME280 supports a full suite of operating modes which provides the flexibility to optimize the device for power consumption, resolution, and filter performance. Technical data: Bosch BME280 Integrated Environmental Units <https://www.bosch-sensortec.com/bst/products/all_products/bme280>; MF: Bosch Sensortec; MPN: BME280; PN_DIGIKEY: 828-1063-1-ND; PN_MOUSER: 262-BME280
U5 = ORBiT-IC-Bosch:BMX055: Bosch BMX055 Absolute Orientation Sensors The absolute orientation sensor BMX055 is a very small, 9-axis sensor, consisting of a triaxial 12 bit acceleration sensor, a triaxial 16 bit, ±2000°/s gyroscope and a triaxial geomagnetic sensor. The BMX055 allows accurate measurement of angular rate, acceleration and geomagnetic fields in 3 perpendicular axes within one device. Technical data: Bosch BMX055 Absolute Orientation Sensors <https://www.bosch-sensortec.com/bst/products/all_products/bmx055>; MF: Bosch Sensortec; MPN: BMX055; PN_DIGIKEY: 828-1060-1-ND; PN_MOUSER: 262-BMX055
U6 = ORBiT-IC-Maxim:DS3231M: ±5ppm, I2C Real-Time Clock The DS3231M is a low-cost, extremely accurate, I2C real-time clock (RTC). The device incorporates a battery input and maintains accurate timekeeping when main power to the device is interrupted. The integration of the microelectromechanical systems (MEMS) resonator enhances the long-term accuracy of the device and reduces the piece-part count in a manufacturing line. The DS3231M is available in the same footprint as the popular DS3231 RTC. The RTC maintains seconds, minutes, hours, day, date, month, and year information. The date at the end of the month is automatically adjusted for months with fewer than 31 days, including corrections for leap year. The clock operates in either the 24-hour or 12-hour format with an active-low AM/PM indicator. Two programmable time-of-day alarms and a 1Hz output are provided. Address and data are transferred serially through an I2C bidirectional bus. A precision temperature-compensated voltage reference and comparator circuit monitors the status of VCC to detect power failures, to provide a reset output, and to automatically switch to the backup supply when necessary. Additionally, the active-low RST pin is monitored as a pushbutton input for generating a microprocessor reset. See the Block Diagram in the full data sheet for more details. Features: Highly Accurate RTC With Integrated MEMS Resonator Completely Manages All Timekeeping Functions Complete Clock Calendar Functionality Including Seconds, Minutes, Hours, Day, Date, Month, and Year, with Leap-Year Compensation Up to Year 2100 Timekeeping Accuracy ±5ppm (±0.432 Second/Day) from -45°C to +85°C Footprint and Functionally Compatible to DS3231 Two Time-of-Day Alarms 1Hz and 32.768kHz Outputs Reset Output and Pushbutton Input with Debounce Digital Temp Sensor with ±3°C Accuracy +2.3V to +5.5V Supply Voltage Simple Serial Interface Connects to Most Microcontrollers Fast (400kHz) I2C Interface Battery-Backup Input for Continuous Timekeeping Low Power Operation Extends Battery-Backup Run Time Operating Temperature Range: (-40°C to +85°C) 8-Pin or 16-Pin SO Packages Underwriters Laboratories® (UL) Recognized Technical data: DS3231M ±5ppm, I2C Real-Time Clock <https://www.maximintegrated.com/en/products/digital/real-time-clocks/DS3231.html>; MF: Maxim Integrated; MPN: DS3231MZ+; PN_DIGIKEY: DS3231MZ+-ND; PN_MOUSER: 700-DS3231MZ+
U7 = ORBiT-IC-TI:LMC555: TI LMC555 CMOS Timer The LMC555 device is a CMOS version of the industry standard 555 series general-purpose timers. In addition to the standard package (SOIC, VSSSOP, and PDIP) the LMC555 is also available in a chip-sized package (8-bump DSBGA) using TI’s DSBGA package technology. The LMC555 offers the same capability of generating accurate time delays and frequencies as the LM555 but with much lower power dissipation and supply current spikes. When operated as a one-shot, the time delay is precisely controlled by a single external resistor and capacitor. In the astable mode the oscillation frequency and duty cycle are accurately set by two external resistors and one capacitor. The use of TI’s LMCMOS process extends both the frequency range and the low supply capability. Features: Industry’s Fastest Astable Frequency of 3MHz Available in Industry’s Smallest 8-Bump DSBGA Package (1.43mm × 1.41mm) Less Than 1 mW Typical Power Dissipation at 5 V Supply 1.5 V Supply Operating Voltage Ensured Output Fully Compatible With TTL and CMOS Logic at 5 V Supply Tested to −10 mA, 50 mA Output Current Levels Reduced Supply Current Spikes During Output Transitions Extremely Low Reset, Trigger, and Threshold Currents Excellent Temperature Stability Pin-for-Pin Compatible With 555 Series of Timers Technical data: World’s smallest 555 timer with low power, high accuracy and a Fmax of 3MHz <http://www.ti.com/product/LMC555>; MF: Texas Instruments; MPN: LMC555CMX; PN_DIGIKEY: LMC555CMX/NOPBCT-ND; PN_MOUSER: 926-LMC555CMX/NOPB
U8 = ORBiT-IC-ON-Semi:CAT24C256: ON Semiconductor CAT24C256 256-Kb Serial I2C EEPROM The CAT24C256 is a EEPROM Serial 256-Kb I2C, internally organized as 512 pages of 64 bytes each, for a total of 32,768 bytes of 8 bits each. It features a 64-byte page write buffer and supports the Standard (100 kHz), Fast (400 kHz) and Fast-Plus (1 MHz) I2C protocol. Write operations can be inhibited by taking the WP pin High (this protects the entire memory). External address pins make it possible to address up to eight CAT24C256 devices on the same bus. On-Chip ECC (Error Correction Code) makes the device suitable for high reliability applications. Features: Supports Standard, Fast and Fast-Plus I2C Protocol 1.8 V to 5.5 V Supply Voltage Range 64-Byte Page Write Buffer Hardware Write Protection for Entire Memory Schmitt Triggers and Noise Suppression Filters on I2C Bus Inputs (SCL and SDA) Low Power CMOS Technology 1,000,000 program/erase cycles 100 Year Data Retention Industrial temperature range Industrial and Extended Temperature Range PDIP, SOIC, TSSOP, MSOP 8-Lead and TDFN, UDFN 8-Pad Packages This Device is Pb-Free, Halogen Free/BFR Free and RoHS Compliant Technical data: CAT24C256: EEPROM Serial 256-Kb I2C <http://www.onsemi.com/PowerSolutions/product.do?id=CAT24C256>; MF: ON Semiconductor; MPN: CAT24C256WI-GT3; PN_DIGIKEY: CAT24C256WI-GT3OSCT-ND; PN_MOUSER: 698-CAT24C256WI-GT3
U9 = ORBiT-IC-TI:LMZ21700: TI LMZ21700 3V to 17V, 0.65A Step-Down DC/DC Power Module The LMZ21700 Nano Module is an easy-to-use step-down DC/DC solution capable of driving up to 650-mA load in space-constrained applications. Only an input capacitor, an output capacitor, a soft-start capacitor, and two resistors are required for basic operation. Technical data: LMZ21700 <http://www.ti.com/product/LMZ21700>; MF: Texas Instruments; MPN: LMZ21700SILR; PN_DIGIKEY: 296-44325-1-ND; PN_MOUSER: 595-LMZ21700SILR
U10 = ORBiT-IC-TI:CD74HC423: CD74*423 High Speed CMOS Logic Dual Retriggerable Monostable Multivibrators with Reset The ’HC123, ’HCT123, CD74HC423 and CD74HCT423 are dual monostable multivibrators with resets. They are all retriggerable and differ only in that the 123 types can be triggered by a negative to positive reset pulse; whereas the 423 types do not have this feature. An external resistor (RX) and an external capacitor (CX) control the timing and the accuracy for the circuit. Adjustment of Rx and CX provides a wide range of output pulse widths from the Q and Q\ terminals. Pulse triggering on the A\ and B inputs occur at a particular voltage level and is not related to the rise and fall times of the trigger pulses. Once triggered, the output pulse width may be extended by retriggering inputs A\ and B. The output pulse can be terminated by a LOW level on the Reset (R) pin. Trailing edge triggering (A)\ and leading edge triggering (B) inputs are provided for triggering from either edge of the input pulse. If either Mono is not used each input on the unused device (A\, B, and R\) must be terminated high or low. The minimum value of external resistance, Rx is typically 5kΩ. The minimum value external capacitance, CX, is 0pF. The calculation for the pulse width is tW = 0.45 RXCX at VCC = 5V. Features: Overriding Reset Terminates Output Pulse Triggering From the Leading or Trailing Edge Q and Q\ Buffered Outputs Separate Resets Wide Range of Output-Pulse Widths Schmitt Trigger on Both A\ and B Inputs Fanout (Over Temperature Range) Standard Outputs . . . . . . . . . . . . . . . 10 LSTTL Loads Bus Driver Outputs . . . . . . . . . . . . . 15 LSTTL Loads Wide Operating Temperature Range . . . –55°C to 125°C Balanced Propagation Delay and Transition Times Significant Power Reduction Compared to LSTTL Logic ICs HC Types 2V to 6V Operation High Noise Immunity: NIL = 30%, NIH = 30% of VCC at VCC = 5V HCT Types 4.5V to 5.5V Operation Direct LSTTL Input Logic Compatibility, VIL = 0.8V (Max), VIH = 2V (Min) CMOS Input Compatibility, Il ≤ 1µA at VOL, VOH Technical data: High Speed CMOS Logic Dual Retriggerable Monostable Multivibrators with Reset <http://www.ti.com/product/CD74HC123>; MF: Texas Instruments; MPN: CD74HC423M; PN_DIGIKEY: 296-26004-5-ND; PN_MOUSER: 595-CD74HC423M
X1 = con-coax:SMA-: SMA 50 Ohm End Launch Jack Receptacle - Round Contact Johnson Components Source: www.johnsoncomponents.com .. J502-ND.pdf; MF: JOHNSON COMPONENTS; MPN: 142-0711-821; OC_FARNELL: 1019328; OC_NEWARK: 16F3627
X2 = ORBiT-con-Molex-Nano-Fit:105314-**06: Molex Nano-Fit Right-Angle Through-Hole Header, 2x3 pins Nano-Fit Power Connectors deliver both fully protected header terminals and a small package, while also offering keying options to ensure proper mating and terminal position assurance (TPA) to reduce terminal back-out. Power-application customers are faced with the decision of choosing between headers with exposed terminals, leaving connectors susceptible to damage, and large, fully-isolated headers that take up too much space. Compact Nano-Fit connectors provide design engineers fully protected header terminals in a small package. Another challenge that design engineers face is meeting the requirement to use multiple headers of the same circuit size on one PCB. This complicates the assembly due to possible mis-mating of a receptacle to the wrong header. Nano-Fit connectors offer different mechanical keying options, enabling customers to reduce the risk of cross mating while improving assembly speed with color-coding logic. Features: The smallest, fully-isolated headers in the market Deliver up to 69% PCB space savings Optional TPA (Terminal Position Assurance) retainer Ensures terminals are fully seated in the housing to reduce terminal back-out Retains terminals if main retention feature fails Positive-lock housing with anti-snag design Ensures mated connector assemblies will not accidentally disengage Provides an audible click while mating. Protects latch from damage due to wire snags Terminal interface with four points of contact Offers redundant, secondary current paths for long-term performance and reliability SMT version enables use of multi-layer boards by eliminating the need for through holes Opens up real estate on space-constricted PCBs Potentially reduces costs by enabling use of smaller PCBs with fewer drilled holes Terminals and headers available in gold and tin plating Delivers different cost options while meeting performance need Multiple mechanical keying and color-coded options Allow same-circuit, multiple-connector use with virtually no chance of cross mating Color coding provides visual indication of the proper mating connector — enabling faster assembly Ultra-low mate force terminal Reduces operator fatigue and improves assembly compliance for high-circuit applications Fully isolated terminals Protect against potential damage of the header and receptacle terminals during handling and mating Retention tang and contact rib Maintains stable contact SMT headers provide short electrical paths Deliver superior signal integrity performance Technical data: Nano-Fit Power Connectors <https://www.molex.com/molex/products/family?key=nanofit_power_connectors>; MF: Molex